# Altium schematic sheet MAXstream.SchDoc
size 297 x 209 mm
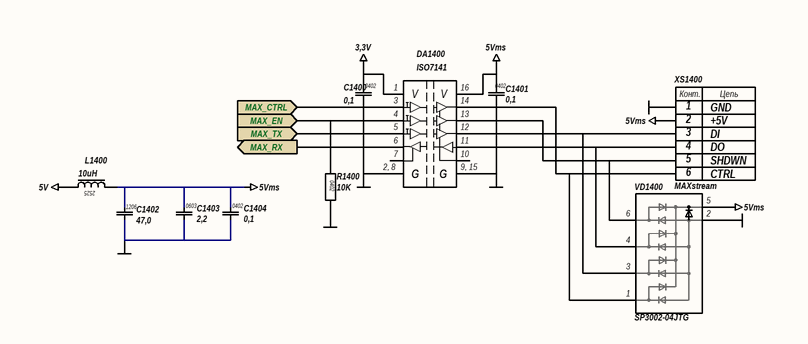
[diagram p0: MAXstream.SchDoc]

## Parts
C1400  0,1  [CAP0402]
C1401  0,1  [CAP0402]
C1402  47,0  [CAP1206]
C1403  2,2  [CAP0603]
C1404  0,1  [CAP0402]
DA1400  ISO7141  [TSSOP16]
L1400  10uH  [IND2525]
R1400  10K  [RES0402]
VD1400  SP3002-04JTG  [SOT323-6]
XS1400  MAXstream  [MW-6M]

## Ports
MAX_CTRL (in), MAX_EN (in), MAX_RX (out), MAX_TX (in)

## Nets
3,3V: C1400.1 DA1400.1(V)
5V: L1400.1
5Vms: C1401.1 C1402.1 C1403.1 C1404.1 DA1400.16(V) L1400.2 VD1400.5 XS1400.2(+5V)
GND: C1400.2 C1401.2 C1402.2 C1403.2 C1404.2 DA1400.2(G) DA1400.8(G) DA1400.9(G) DA1400.15(G) R1400.2 VD1400.2 XS1400.1(GND)
MAX_CTRL: DA1400.3(INA) ; port MAX_CTRL
MAX_EN: DA1400.4(INB) R1400.1 ; port MAX_EN
MAX_RX: DA1400.6(OUTD) ; port MAX_RX
MAX_TX: DA1400.5(INC) ; port MAX_TX
NetDA1400_11: DA1400.11(IND) VD1400.4 XS1400.4(DO)
NetDA1400_12: DA1400.12(OUTC) VD1400.3 XS1400.3(DI)
NetDA1400_13: DA1400.13(OUTB) VD1400.6 XS1400.5(SHDWN)
NetDA1400_14: DA1400.14(OUTA) VD1400.1 XS1400.6(CTRL)

Not connected (* = marked no-connect by the designer): DA1400 7(EN1) 10(EN2)

## Notes on the sheet
- (in symbol ISO7141) 2, 8; 9, 15
- (in symbol Разъем6) Конт.; Цепь

## Library data of the parts
C1400 C1401 C1404 = CAP_0402: Конденсатор чип; Тип корпуса: 0402; Тип монтажа: Поверхностный; Номинал: 0,1; Тип компонента: Конденсатор чип
  C1400 C1401: Value: 0,1
C1402 = CAP_1206: Конденсатор чип; Тип корпуса: 1206; Тип монтажа: Поверхностный; Номинал: 47,0; Тип компонента: Конденсатор чип; Value: 47,0
C1403 = CAP_0603: Конденсатор чип; Напряжение: 50V; Тип корпуса: 0603; Тип монтажа: Поверхностный; Value: 2,2; Номинал: 2,2; Тип компонента: Конденсатор чип
DA1400 = ISO7141: Цифровой изолятор 3 вх 1 вых; Производитель: Texas Instruments; Тип корпуса: SSOP16; Тип монтажа: Поверхностный; Наименование: ISO7141; Тип компонента: Цифровой изолятор 3 вх 1 вых
L1400 = IND_2525: Индуктивность чип; Тип корпуса: 2525; Тип монтажа: Поверхностный; Характеристики: 3А; Номинал: 10uH; Тип компонента: Индуктивность чип; Value: 10uH
R1400 = RES_0402: Резистор чип; Тип корпуса: 0402; Тип монтажа: Поверхностный; Характеристики: 0.062Вт 50В; Номинал: 10K; Тип компонента: Резистор чип; Value: 10K
VD1400 = SP3002-04JTG: Сборка диодная Шоттки 8 шт. + ESD; Производитель: Fairchild Semiconductor; Тип монтажа: Поверхностный; Характеристики: 6В 12кВ 0.85пФ; Тип компонента: Сборка диодная Шоттки 8 шт. + ESD; Тип корпуса: SOT323-6; Наименование: SP3002-04JTG
XS1400 = Разъем6: Разъем